# EAGLE design AmbilightUSB (EAGLE 5.10)
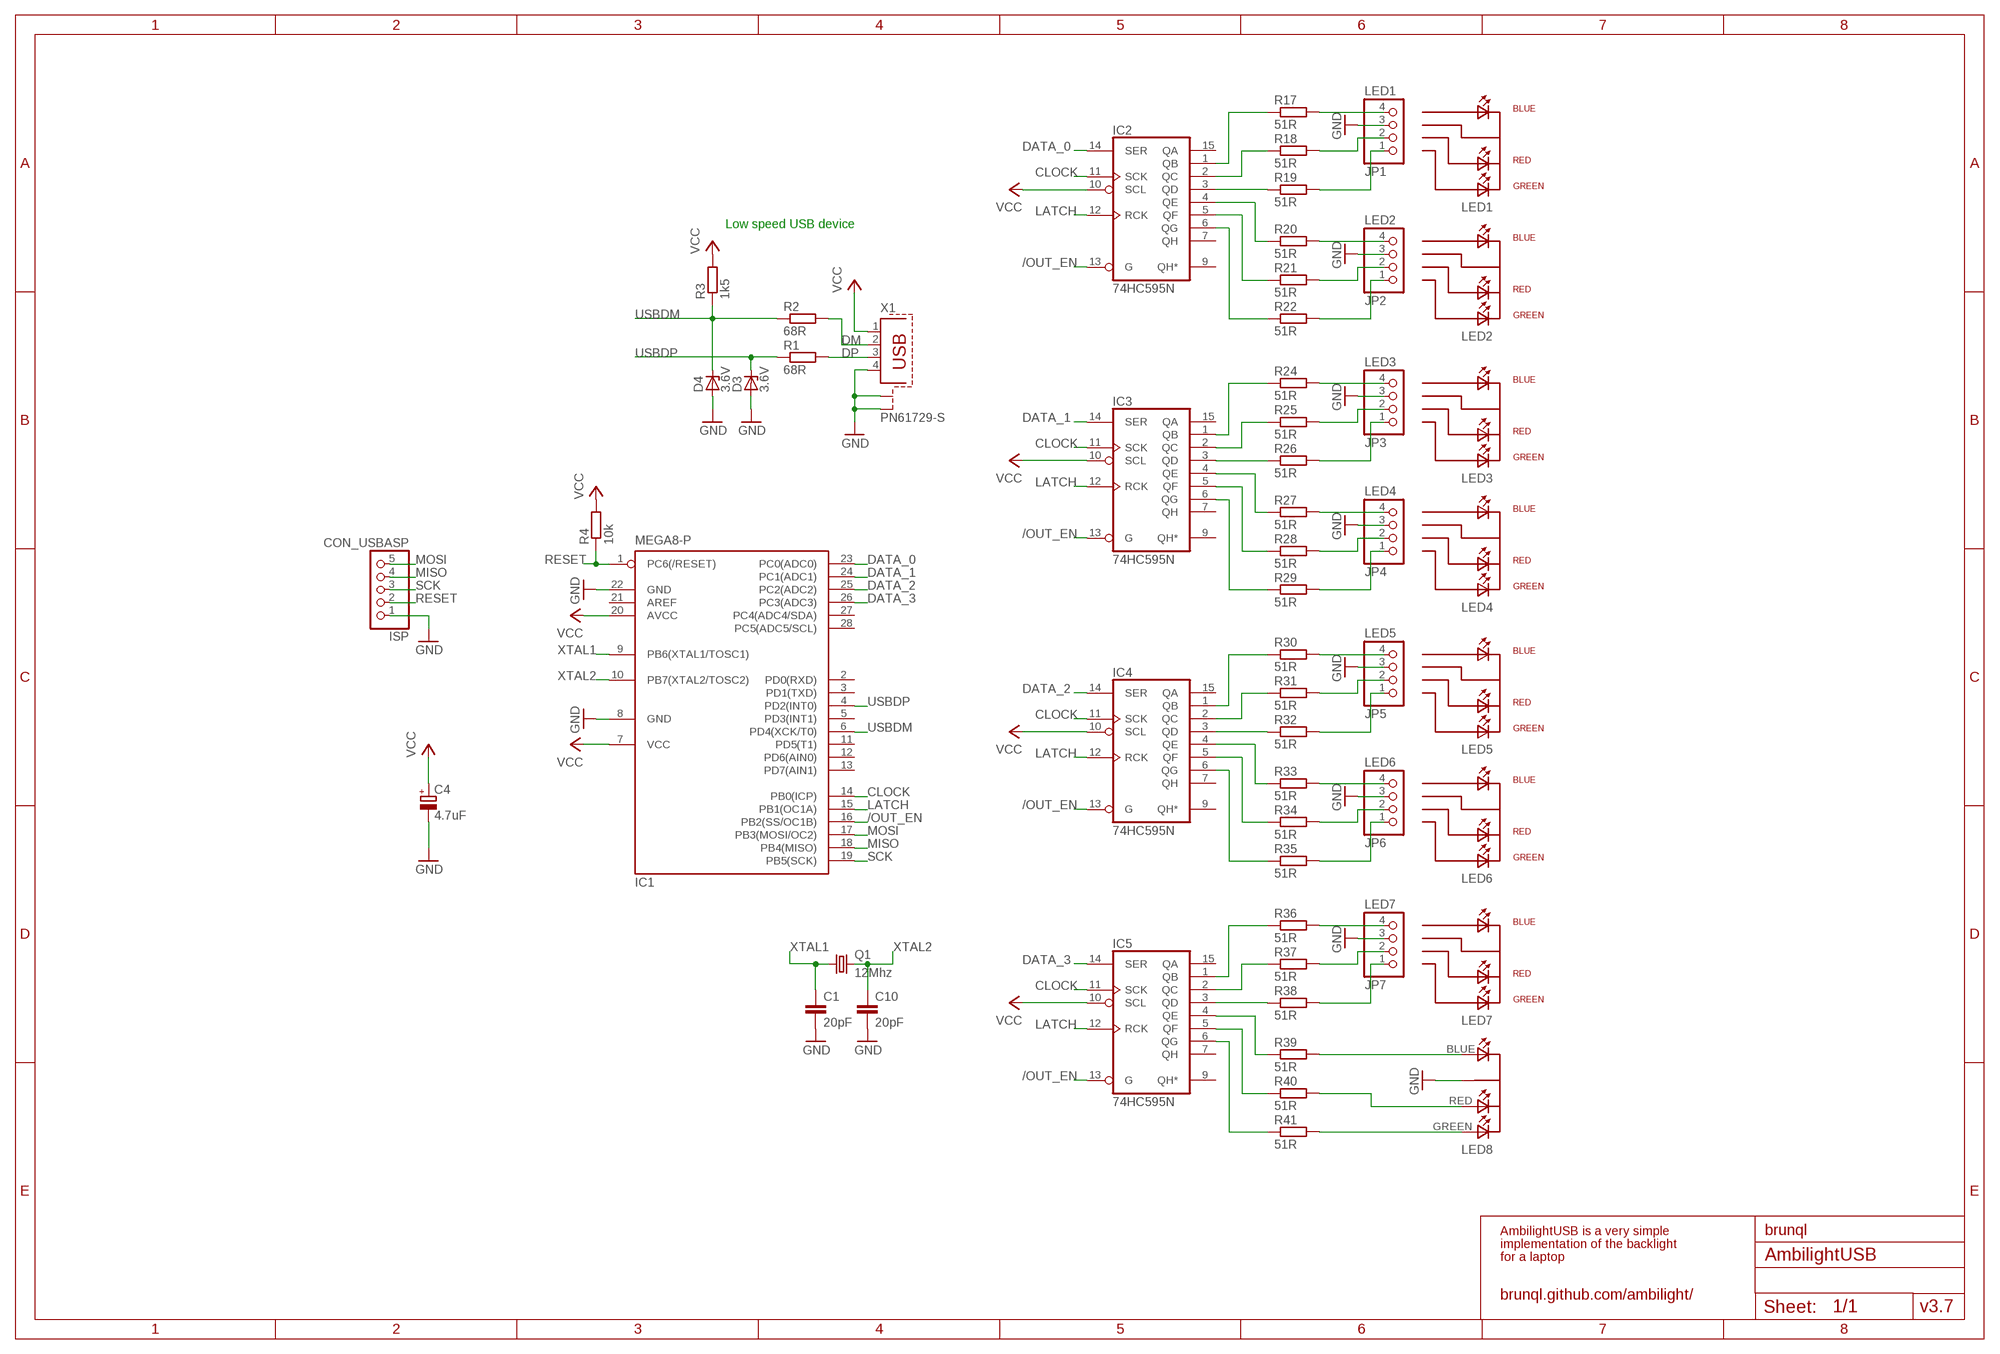
[diagram p0: schematic, sheet 1]

## Parts
C1  20pF  C-EU025-025X050  [C025-025X050]
C4  4.7uF  CPOL-EUE2-5  [E2-5]
C10  20pF  C-EU025-025X050  [C025-025X050]
D3  3.6V  ZENER-DIODEDO35Z10  [DO35Z10]
D4  3.6V  ZENER-DIODEDO35Z10  [DO35Z10]
IC1  MEGA8-P  [DIL28-3]
IC2  74HC595N  [DIL16]
IC3  74HC595N  [DIL16]
IC4  74HC595N  [DIL16]
IC5  74HC595N  [DIL16]
ISP  CON_USBASP  PINHD-1X5  [1X05]
JP1  LED1  PINHD-1X4/90  [1X04/90]
JP2  LED2  PINHD-1X4/90  [1X04/90]
JP3  LED3  PINHD-1X4/90  [1X04/90]
JP4  LED4  PINHD-1X4/90  [1X04/90]
JP5  LED5  PINHD-1X4/90  [1X04/90]
JP6  LED6  PINHD-1X4/90  [1X04/90]
JP7  LED7  PINHD-1X4/90  [1X04/90]
LED1  LED-DIP-3-TO-BLS-SOCKET  [LED-TO-BLS-SOCKET]
LED2  LED-DIP-3-TO-BLS-SOCKET  [LED-TO-BLS-SOCKET]
LED3  LED-DIP-3-TO-BLS-SOCKET  [LED-TO-BLS-SOCKET]
LED4  LED-DIP-3-TO-BLS-SOCKET  [LED-TO-BLS-SOCKET]
LED5  LED-DIP-3-TO-BLS-SOCKET  [LED-TO-BLS-SOCKET]
LED6  LED-DIP-3-TO-BLS-SOCKET  [LED-TO-BLS-SOCKET]
LED7  LED-DIP-3-TO-BLS-SOCKET  [LED-TO-BLS-SOCKET]
LED8  LED-DIP-3  [DIP-4]
Q1  12Mhz  CRYSTALHC49S  [HC49/S]
R1  68R  R-EU_0207/10  [0207/10]
R2  68R  R-EU_0207/10  [0207/10]
R3  1k5  R-EU_0207/10  [0207/10]
R4  10k  R-EU_0207/10  [0207/10]
R17  51R  R-EU_0207/10  [0207/10]
R18  51R  R-EU_0207/10  [0207/10]
R19  51R  R-EU_0207/10  [0207/10]
R20  51R  R-EU_0207/10  [0207/10]
R21  51R  R-EU_0207/10  [0207/10]
R22  51R  R-EU_0207/10  [0207/10]
R24  51R  R-EU_0207/10  [0207/10]
R25  51R  R-EU_0207/10  [0207/10]
R26  51R  R-EU_0207/10  [0207/10]
R27  51R  R-EU_0207/10  [0207/10]
R28  51R  R-EU_0207/10  [0207/10]
R29  51R  R-EU_0207/10  [0207/10]
R30  51R  R-EU_0207/10  [0207/10]
R31  51R  R-EU_0207/10  [0207/10]
R32  51R  R-EU_0207/10  [0207/10]
R33  51R  R-EU_0207/10  [0207/10]
R34  51R  R-EU_0207/10  [0207/10]
R35  51R  R-EU_0207/10  [0207/10]
R36  51R  R-EU_0207/10  [0207/10]
R37  51R  R-EU_0207/10  [0207/10]
R38  51R  R-EU_0207/10  [0207/10]
R39  51R  R-EU_0207/10  [0207/10]
R40  51R  R-EU_0207/10  [0207/10]
R41  51R  R-EU_0207/10  [0207/10]
X1  PN61729-S  [PN61729-S]

## Nets
/OUT_EN: IC1.16(PB2(SS/OC1B)) IC2.13(G) IC3.13(G) IC4.13(G) IC5.13(G)
CLOCK: IC1.14(PB0(ICP)) IC2.11(SCK) IC3.11(SCK) IC4.11(SCK) IC5.11(SCK)
DATA_0: IC1.23(PC0(ADC0)) IC2.14(SER)
DATA_1: IC1.24(PC1(ADC1)) IC3.14(SER)
DATA_2: IC1.25(PC2(ADC2)) IC4.14(SER)
DATA_3: IC1.26(PC3(ADC3)) IC5.14(SER)
DM: R2.2 X1.2
DP: R1.2 X1.3
GND: C1.2 C4.- C10.2 D3.A D4.A IC1.8(GND) IC1.22(GND) ISP.1 JP1.3 JP2.3 JP3.3 JP4.3 JP5.3 JP6.3 JP7.3 LED8.COMMON_CATHODE(COM-CATHODE) X1.4 X1.S1 X1.S2
LATCH: IC1.15(PB1(OC1A)) IC2.12(RCK) IC3.12(RCK) IC4.12(RCK) IC5.12(RCK)
MISO: IC1.18(PB4(MISO)) ISP.4
MOSI: IC1.17(PB3(MOSI/OC2)) ISP.5
N$1: JP2.1 R22.2
N$2: JP2.2 R21.2
N$3: JP1.1 R19.2
N$4: JP1.2 R18.2
N$5: JP3.1 R26.2
N$6: IC2.1(QB) R17.1
N$7: JP3.2 R25.2
N$8: JP4.1 R29.2
N$10: IC2.2(QC) R18.1
N$11: LED8.BLUE R39.2
N$12: IC2.3(QD) R19.1
N$13: JP1.4 R17.2
N$14: JP2.4 R20.2
N$15: JP7.4 R36.2
N$16: JP6.4 R33.2
N$17: JP5.4 R30.2
N$18: JP4.4 R27.2
N$19: IC2.6(QG) R22.1
N$20: IC2.5(QF) R21.1
N$21: JP3.4 R24.2
N$22: IC5.3(QD) R38.1
N$23: IC4.3(QD) R32.1
N$24: IC3.3(QD) R26.1
N$25: LED8.RED R40.2
N$26: IC2.4(QE) R20.1
N$27: LED8.GREEN R41.2
N$46: IC3.1(QB) R24.1
N$47: IC3.2(QC) R25.1
N$49: IC3.6(QG) R29.1
N$50: IC3.5(QF) R28.1
N$51: IC3.4(QE) R27.1
N$56: JP4.2 R28.2
N$66: IC4.1(QB) R30.1
N$67: IC4.2(QC) R31.1
N$69: IC4.6(QG) R35.1
N$70: IC4.5(QF) R34.1
N$71: IC4.4(QE) R33.1
N$73: JP5.2 R31.2
N$74: JP5.1 R32.2
N$75: JP6.1 R35.2
N$76: JP6.2 R34.2
N$86: IC5.1(QB) R36.1
N$87: IC5.2(QC) R37.1
N$89: IC5.6(QG) R41.1
N$90: IC5.5(QF) R40.1
N$91: IC5.4(QE) R39.1
N$93: JP7.2 R37.2
N$94: JP7.1 R38.2
RESET: IC1.1(PC6(/RESET)) ISP.2 R4.1
SCK: IC1.19(PB5(SCK)) ISP.3
USBDM: D4.C IC1.6(PD4(XCK/T0)) R2.1 R3.1
USBDP: D3.C IC1.4(PD2(INT0)) R1.1
VCC: C4.+ IC1.7(VCC) IC1.20(AVCC) IC2.10(SCL) IC3.10(SCL) IC4.10(SCL) IC5.10(SCL) R3.2 R4.2 X1.1
XTAL1: C1.1 IC1.9(PB6(XTAL1/TOSC1)) Q1.1
XTAL2: C10.1 IC1.10(PB7(XTAL2/TOSC2)) Q1.2
Unconnected: IC1.2(PD0(RXD)) IC1.3(PD1(TXD)) IC1.5(PD3(INT1)) IC1.11(PD5(T1)) IC1.12(PD6(AIN0)) IC1.13(PD7(AIN1)) IC1.21(AREF) IC1.27(PC4(ADC4/SDA)) IC1.28(PC5(ADC5/SCL)) IC2.7(QH) IC2.9(QH*) IC2.15(QA) IC3.7(QH) IC3.9(QH*) IC3.15(QA) IC4.7(QH) IC4.9(QH*) IC4.15(QA) IC5.7(QH) IC5.9(QH*) IC5.15(QA)

## Notes on the sheet
- Low speed USB device
- AmbilightUSB is a very simple | brunql
- implementation of the backlight
- for a laptop
- brunql.github.com/ambilight/
- v3.7

## Power pins joined to a net without a drawn wire
GND: IC2.8(GND) IC3.8(GND) IC4.8(GND) IC5.8(GND)
VCC: IC2.16(VCC) IC3.16(VCC) IC4.16(VCC) IC5.16(VCC)

## Library data of the parts
C1 C10 = rcl:C-EU: CAPACITOR, European symbol
C4 = rcl:CPOL-EU: POLARIZED CAPACITOR, European symbol
D3 D4 = diode:ZENER-DIODE: Z-Diode
IC1 = atmel:MEGA8-P: MICROCONTROLLER 8 Kbytes FLASH, 1 kbytes SRAM, 512 bytes EEPROM, USART, 4-channel 10 bit ADC, 2-channel 8 bit ADC Pin compatible with Atmega48, ATMega88, ATMega168 Source: avr.lbr
IC2-IC5 = 74xx-eu:74*595: 8-bit SHIFT REGISTER, output latch
ISP = pinhead:PINHD-1X5: PIN HEADER
JP1-JP7 = pinhead:PINHD-1X4: PIN HEADER
LED1-LED7 = led-rgb:LED-DIP-3-TO-BLS-SOCKET: RGB DIP LED Edited: brunql DIP 4 Pin Special for AmbilightUSB
LED8 = led-rgb:LED-DIP-3: RGB DIP LED Edited: brunql DIP 4 Pin Special for AmbilightUSB
Q1 = crystal:CRYSTAL: CRYSTAL
R1-R4 R17-R22 R24-R41 = rcl:R-EU_: RESISTOR, European symbol
X1 = con-berg:PN61729-S: BERG USB connector

## Board
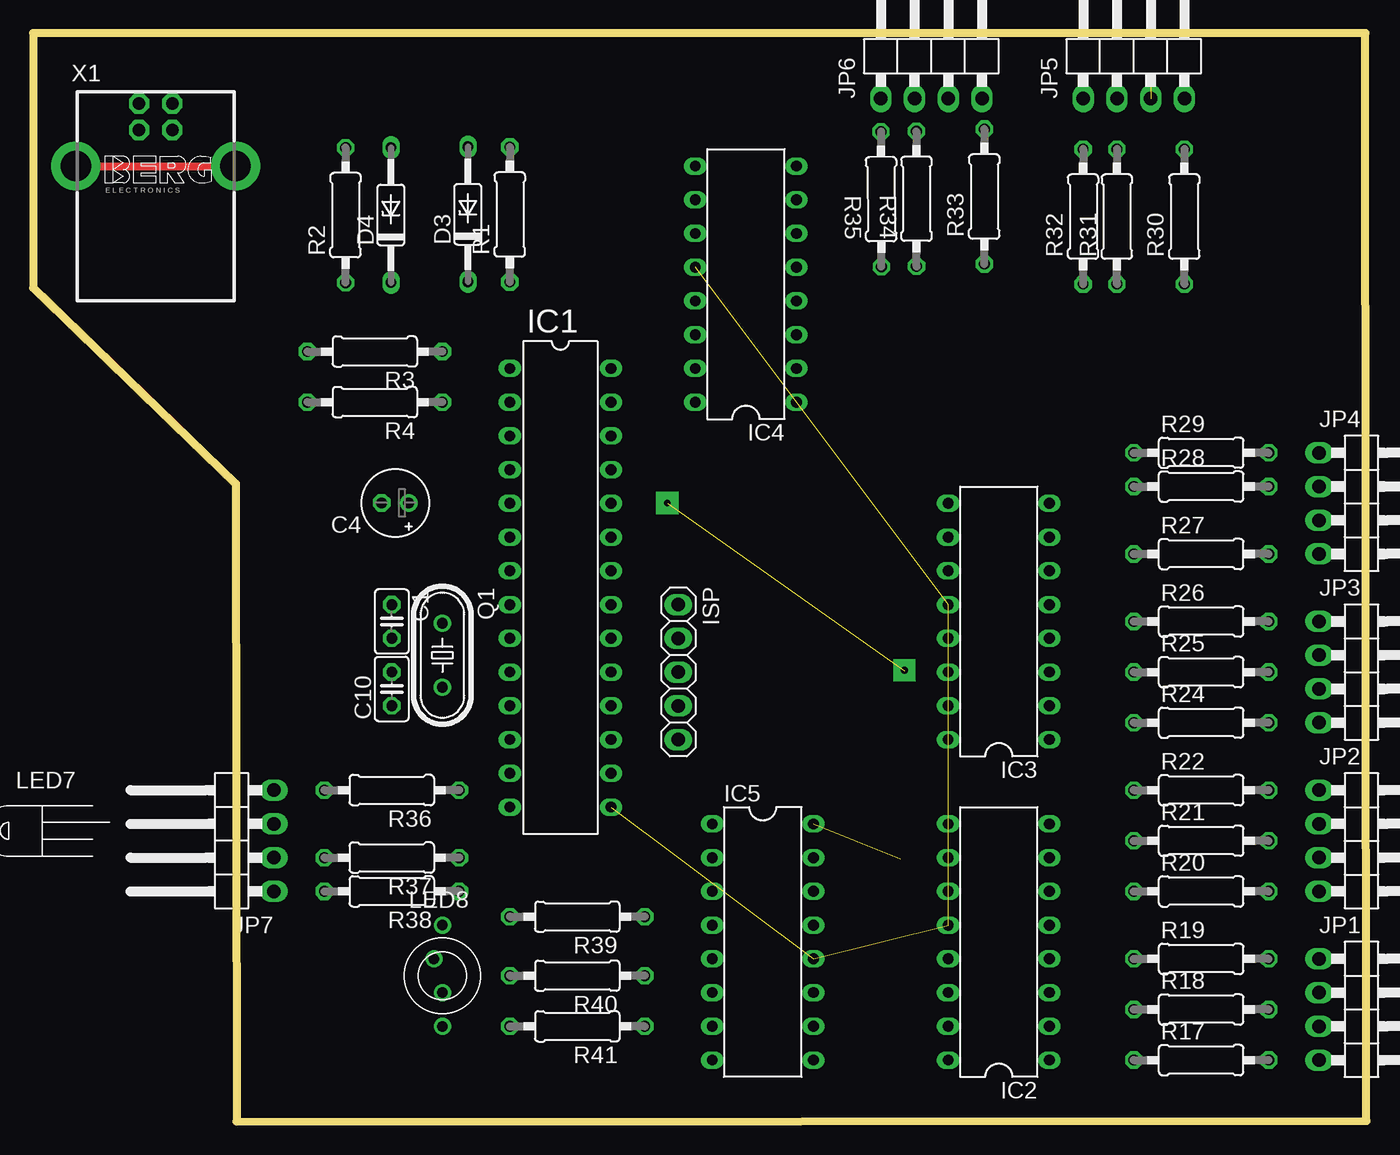
[diagram p1: board, top side]
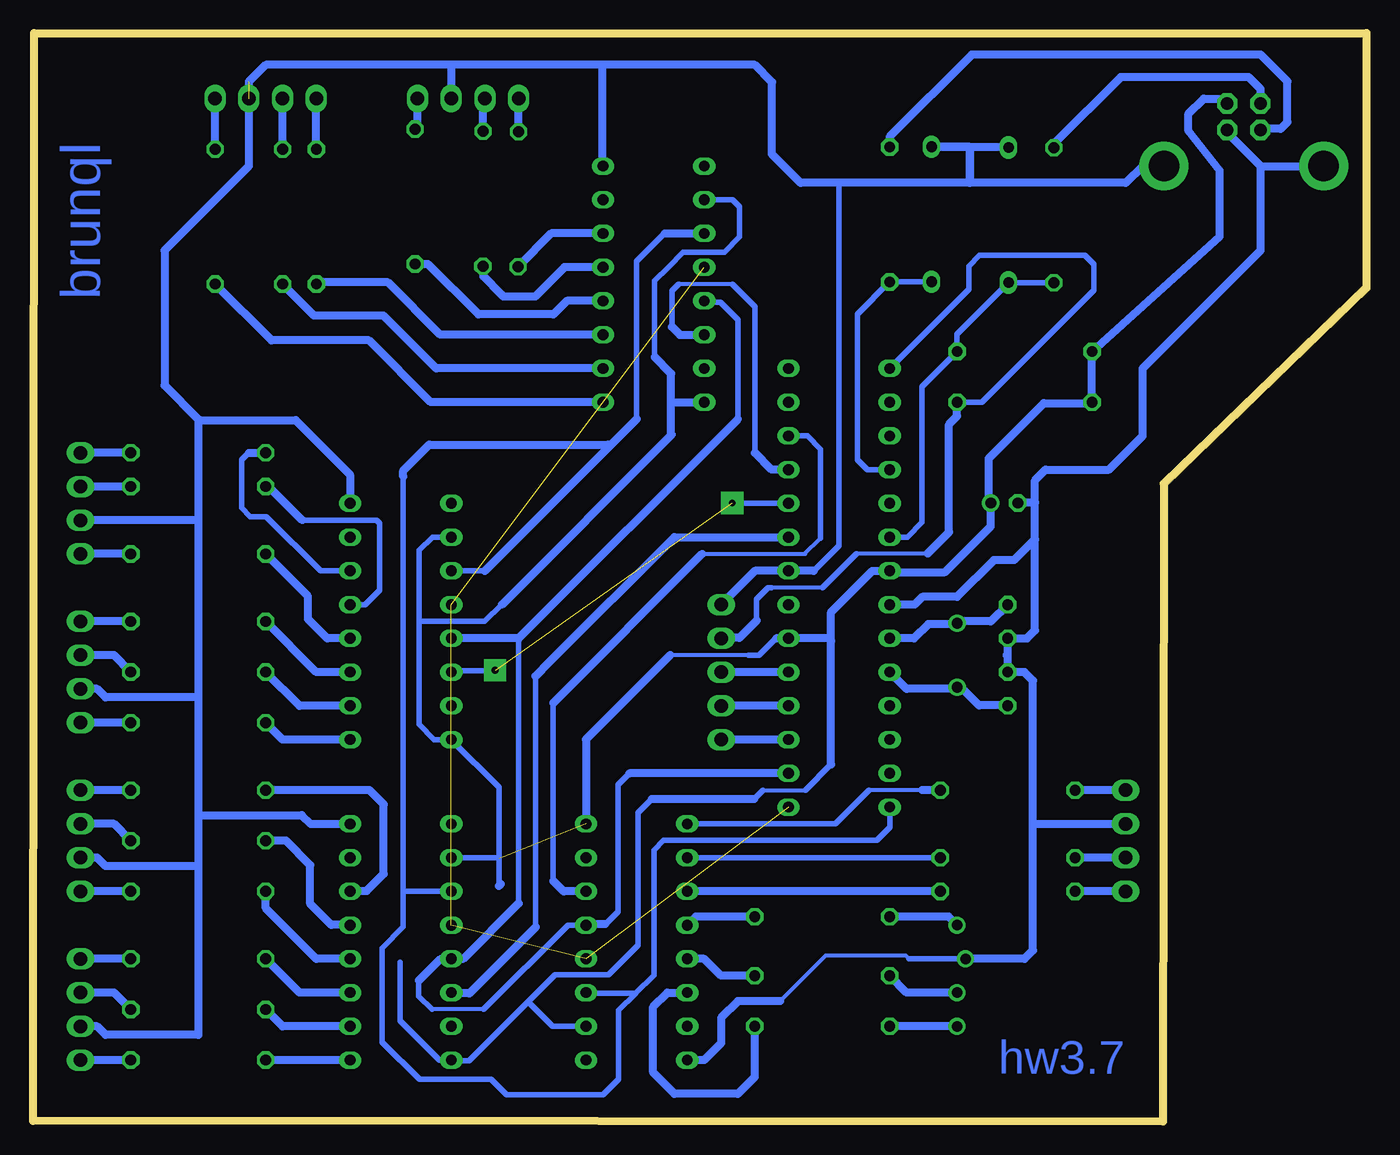
[diagram p2: board, bottom side, seen from below]

Size 100.4 x 81.95 mm. Coordinates in mm from the lower left corner, seen from the top.
Outline: 100.4,0.05 100.33,81.95 0,81.95 0,62.78 15.25,48.04 15.32,0 100.4,0.05
Copper layers (1*16): Top 0.035mm / dielectric 1.5mm / Bottom 0.035mm
Design rules "brunql *": minimum track width 0.32mm, minimum drill 0.8mm, track to track 1mm, track to pad 1mm, pad to pad 1mm, via to via 1mm, smd to smd 0.5mm, copper to edge 2mm, drill to drill 1mm, minimum pad ring 0.2mm, minimum via ring 8mil, stop-mask expansion 4mil, vias tented up to drill 0mil, thermal gap 0.2mm

### Footprints (pad centres in the part's own frame; a part is rotated, then mirrored left to right if it is on the bottom)
C025-025X050 = drill 0.813 octagon: 1 -1.27,0; 2 1.27,0
E2-5 = drill 0.813 pad 1.27 round: + -1.016,0 | drill 0.813 pad 1.27 octagon: - 1.016,0
DO35Z10 = drill 0.813 long: A 5.08,0; C -5.08,0
DIL28-3 = drill 0.813 long: 1 -16.51,-3.81; 2 -13.97,-3.81; 3 -11.43,-3.81; 4 -8.89,-3.81; 5 -6.35,-3.81; 6 -3.81,-3.81; 7 -1.27,-3.81; 8 1.27,-3.81; 9 3.81,-3.81; 10 6.35,-3.81; 11 8.89,-3.81; 12 11.43,-3.81; 13 13.97,-3.81; 14 16.51,-3.81; 15 16.51,3.81; 16 13.97,3.81; 17 11.43,3.81; 18 8.89,3.81; 19 6.35,3.81; 20 3.81,3.81; 21 1.27,3.81; 22 -1.27,3.81; 23 -3.81,3.81; 24 -6.35,3.81; 25 -8.89,3.81; 26 -11.43,3.81; 27 -13.97,3.81; 28 -16.51,3.81
DIL16 = drill 0.813 long: 1 -8.89,-3.81; 2 -6.35,-3.81; 3 -3.81,-3.81; 4 -1.27,-3.81; 5 1.27,-3.81; 6 3.81,-3.81; 7 6.35,-3.81; 8 8.89,-3.81; 9 8.89,3.81; 10 6.35,3.81; 11 3.81,3.81; 12 1.27,3.81; 13 -1.27,3.81; 14 -3.81,3.81; 15 -6.35,3.81; 16 -8.89,3.81
1X05 = drill 1.016 long: 1 -5.08,0; 2 -2.54,0; 3 0,0; 4 2.54,0; 5 5.08,0
1X04/90 = drill 1.016 long: 1 -3.81,-3.81; 2 -1.27,-3.81; 3 1.27,-3.81; 4 3.81,-3.81
DIP-4 = drill 0.8 round: BLUE 0,5.08; COMMON_CATHODE -0.635,2.54; GREEN 0,-2.54; RED 0,0
HC49/S = drill 0.813 round: 1 -2.413,0; 2 2.413,0
0207/10 = drill 0.813 octagon: 1 -5.08,0; 2 5.08,0
PN61729-S = drill 0.95 octagon: 1 1.25,4.71; 2 -1.25,4.71; 3 -1.25,2.71; 4 1.25,2.71 | drill 2.3 pad 2.9 round: S1 -6.02,0; S2 6.02,0

### Placement (x,y rotation side)
C1  27.01,37.66 270 top
C4  27.27,46.58 180 top
C10  27.01,32.58 90 top
D3  32.74,68.31 90 top
D4  26.94,68.26 90 top
IC1  39.7,40.2 270 top
IC2  72.72,13.53 90 top
IC3  72.72,37.66 90 top
IC4  53.68,63.06 90 top
IC5  54.95,13.53 270 top
ISP  48.59,33.85 270 top
JP1  100.66,8.45 270 top
JP2  100.66,21.15 270 top
JP3  100.66,33.85 270 top
JP4  100.66,46.55 270 top
JP5  82.88,80.84 0 top
JP6  67.64,80.84 0 top
JP7  14.31,21.15 90 top
LED1  114.64,9.56 0 top  (outside the outline)
LED2  113.89,21.11 0 top  (outside the outline)
LED3  114.23,33.9 0 top  (outside the outline)
LED4  114.29,46.55 0 top  (outside the outline)
LED5  82.46,94.22 90 top  (outside the outline)
LED6  67.65,93.41 90 top  (outside the outline)
LED7  1.96,21.26 180 top
LED8  30.82,9.72 0 top
Q1  30.82,35.12 270 top
R1  35.9,68.3 90 top
R2  23.52,68.25 90 top
R3  25.73,57.98 180 top
R4  25.73,54.17 180 top
R17  87.96,4.64 0 top
R18  87.96,8.45 0 top
R19  87.96,12.26 0 top
R20  87.96,17.34 0 top
R21  87.96,21.15 0 top
R22  87.96,24.96 0 top
R24  87.96,30.04 0 top
R25  87.96,33.85 0 top
R26  87.96,37.66 0 top
R27  87.96,42.74 0 top
R28  87.96,47.82 0 top
R29  87.96,50.36 0 top
R30  86.69,68.14 90 top
R31  81.61,68.14 90 top
R32  79.07,68.14 90 top
R33  71.63,69.64 90 top
R34  66.52,69.48 90.1 top
R35  63.87,69.45 90.2 top
R36  27.01,24.96 180 top
R37  27.01,19.88 180 top
R38  27.01,17.34 180 top
R39  40.98,15.43 180 top
R40  40.98,10.99 180 top
R41  40.98,7.18 180 top
X1  9.23,71.95 0 top

### Tracks (layer width: path | path; a pad name or v marks a point on that pad's centre or on a via)
/OUT_EN
  Bottom 0.305: 66.47,8.45 70.35,8.45
  Bottom 0.406: 63.84,16.43 63.84,36.39 | 70.35,8.45 71.36,9.46 71.36,10.61 | IC5.13 60.12,14.8 66.47,8.45 | 47.33,52.9 47.33,60.39 48.62,61.68 49.76,61.68 IC4.13 | 55.5,26.23 56.34,25.38 56.34,15.82 57.28,14.88 57.31,14.88
  Bottom 0.61: IC3.13 63.84,36.39 47.33,52.9 | IC1.16 55.5,26.23 | 57.31,14.88 58.68,14.88 IC5.13 | 63.84,16.43 68,12.27 IC2.13 69.71,12.26 71.36,10.61
CLOCK
  Bottom 0.406: 52.84,66.87 54.95,64.76 54.95,52.9 | IC1.14 35.9,22.15 36.87,21.18 52.92,21.18 53.65,20.44 53.65,11.03 55.03,9.65 | 72.53,17.24 72.53,14.66 74.12,13.07 74.12,6 71.31,3.19 65.93,3.19 64.76,2.02 57.48,2.02 56.31,3.2 56.31,8.37 55.03,9.64 55.03,9.65 | IC2.11 72.43,17.34 72.53,17.24 | 72.53,17.24 72.53,48.56 | 66.38,41.47 IC3.11 | IC5.11 58.69,9.65 55.03,9.65
  Bottom 0.61: 56.97,50.87 54.95,52.9 54.96,52.91 | 56.97,50.87 66.38,41.47 | 52.84,66.87 IC4.11 | 72.53,48.56 72.53,49.01 70.57,50.97 57.07,50.97 56.97,50.87
DATA_0
  Bottom 0.406: 62.56,14.64 62.56,33.56 61.55,34.57
  Bottom 0.61: IC1.23 52.11,44.01 61.55,34.57 62.58,33.54 | 62.56,14.64 67.55,9.66 68.85,9.66 IC2.14
DATA_1  (1 unrouted)
  Bottom 0.406: IC1.24 47.78,46.54 | IC3.14 68.8,33.96 65.63,33.96
DATA_2
  Bottom 0.305: 47.73,63.04 51.77,63.04
  Bottom 0.406: 51.77,63.04 51.78,63.06 52.3,62.54 52.3,59.83 | 46.05,50.36 46.05,61.36 47.73,63.04
  Bottom 0.61: 46.05,50.36 44.79,49.09 IC1.25 | IC4.14 49.88,59.23 51.7,59.23 52.3,59.83
DATA_3
  Bottom 0.305: 50.02,42.74 42.3,42.74 | 42.3,42.74 42.24,42.74 | 42.3,42.74 41.1,43.93
  Bottom 0.406: 61.25,18.13 61.25,31.51 | IC1.26 42.09,51.63 41.1,50.64 41.1,43.93
  Bottom 0.61: IC5.14 60.45,17.34 61.25,18.13 | 61.25,31.51 50.02,42.74
DM
  Bottom 0.61: X1.2 7.95,76.68 7.95,77.73 8.87,78.65 18.5,78.65 23.52,73.63 R2.2
DP
  Bottom 0.61: X1.3 7.9,74.74 6.46,74.74 5.94,75.26 5.94,78.32 7.96,80.34 29.71,80.34 35.9,74.15 R1.2
GND  (1 unrouted)
  Top 0.61: X1.S1 X1.S2
  Bottom 0.305: 34.43,12.26 34.68,12.51 40.73,12.51 44.15,9.08
  Bottom 0.406: 39.7,70.68 39.7,43.37 41.61,41.47 | 87.96,22.97 87.83,23.11 | LED8.COMMON_CATHODE 34.43,12.26 | 26.99,73.39 D4.A | 29.85,70.88 29.91,70.82
  Bottom 0.61: 27.01,35.05 C10.2 25.73,33.85 25.1,33.21 25.1,22.42 | 27.01,35.05 C1.2 25.56,36.39 24.96,36.99 24.96,43.85 | 15.58,71.95 X1.S2 16.85,71.95 18.12,70.68 29.86,70.68 | 7.96,71.95 10.5,74.49 X1.4 | 7.96,71.95 X1.S1 | 68.91,79.57 JP6.3 | 57.57,79.57 46.05,79.57 44.75,78.26 44.77,78.25 44.77,72.84 42.6,70.68 39.7,70.68 29.86,70.68 | 57.57,79.57 68.91,79.57 | 7.96,71.95 7.96,65.6 16.85,56.71 16.85,51.63 19.39,49.09 24.15,49.09 24.96,48.28 24.96,46.61 | 41.61,41.47 IC1.22 46.05,41.47 ISP.1 | IC5.8 49.87,4.64 48.59,5.91 48.59,7.81 47.33,9.08 44.15,9.08 | LED8.COMMON_CATHODE 25.73,12.26 25.1,12.89 25.1,22.42 | 25.1,22.42 JP7.3 | 68.91,79.57 82.88,79.57 84.15,78.3 84.15,71.95 90.5,65.6 90.5,55.44 87.96,52.9 | 87.96,52.9 87.96,45.28 | 87.96,45.28 JP4.3 | 87.96,45.28 87.96,31.94 | JP1.3 95.58,7.18 94.95,6.54 87.96,6.54 87.96,19.24 | 87.96,31.94 87.96,22.97 87.96,19.24 | JP2.3 95.58,19.88 94.95,19.24 87.96,19.24 | JP3.3 95.58,32.58 94.95,31.94 87.96,31.94 | 27.01,35.05 27.08,35.12 27.1,35.1 | 24.96,43.85 24.96,46.61 | C4.- 24.99,46.58 24.96,46.61 | IC1.8 34.02,38.93 33.44,39.51 30.82,39.51 28.06,42.28 26.53,42.28 24.96,43.85 | IC3.8 76.53,48.72 80.63,52.82 87.88,52.82 87.96,52.9 | IC4.8 57.57,71.95 57.57,79.57 | 29.86,73.39 26.99,73.39 | 29.86,73.39 D3.A 29.86,73.39 29.86,70.68 | 29.85,70.88 29.86,70.88 29.86,73.39 | IC2.8 79.5,22.42 80.17,23.09 87.81,23.09 87.83,23.11
LATCH  (4 unrouted)
MISO
  Bottom 0.61: IC1.18 ISP.4
MOSI
  Bottom 0.61: IC1.17 ISP.5
N$1
  Bottom 0.61: R22.2 JP2.1
N$2
  Bottom 0.61: R21.2 94.31,22.42 JP2.2
N$3
  Bottom 0.61: R19.2 JP1.1
N$4
  Bottom 0.61: R18.2 94.31,9.72 JP1.2
N$5
  Bottom 0.61: R26.2 JP3.1
N$6
  Bottom 0.61: IC2.1 R17.1
N$7
  Bottom 0.61: R25.2 94.31,35.12 JP3.2
N$8
  Bottom 0.61: R29.2 JP4.1
N$10
  Bottom 0.61: IC2.2 81.61,7.18 R18.1
N$11
  Bottom 0.61: R39.2 31.45,15.43 LED8.BLUE
N$12
  Bottom 0.61: IC2.3 80.34,9.72 R19.1
N$13
  Bottom 0.61: R17.2 JP1.4
N$14
  Bottom 0.61: R20.2 JP2.4
N$15
  Bottom 0.61: JP7.4 R36.2
N$16
  Bottom 0.61: JP6.4 71.45,74.9 R33.2
N$17
  Bottom 0.61: R30.2 JP5.4
N$18
  Bottom 0.61: R27.2 JP4.4
N$19
  Bottom 0.61: IC2.6 76.49,17.38 75.27,17.38 73.99,18.66 73.99,23.88 75.07,24.96 R22.1
N$20
  Bottom 0.406: R21.1 82.86,21.12
  Bottom 0.61: R21.1 81.36,21.15 79.53,19.32 79.53,16.4 77.95,14.82 76.56,14.82 IC2.5
N$21
  Bottom 0.61: R24.2 JP3.4
N$22
  Bottom 0.61: R38.1 IC5.3
N$23
  Bottom 0.61: IC4.3 69.75,59.25 73.68,63.18 78.95,63.18 R32.1
N$24
  Bottom 0.61: R26.1 79.07,33.85 IC3.3
N$25
  Bottom 0.61: R40.2 34.62,9.72 LED8.RED
N$26
  Bottom 0.61: IC2.4 79.07,12.26 82.88,16.07 R20.1
N$27
  Bottom 0.61: LED8.GREEN R41.2
N$46
  Bottom 0.61: R24.1 81.61,28.77 IC3.1
N$47
  Bottom 0.61: R25.1 80.34,31.31 IC3.2
N$49
  Bottom 0.406: IC3.6 78.77,41.47 82.85,45.55 84.05,45.55 84.7,46.2 84.7,49.82 84.15,50.36
  Bottom 0.61: 84.15,50.36 R29.1
N$50
  Bottom 0.406: 80.14,45.28 80.12,45.27 74.54,45.27 74.32,45.04 74.32,40 75.39,38.93 IC3.5
  Bottom 0.61: R28.1 82.67,47.82 80.14,45.28
N$51
  Bottom 0.61: R27.1 79.7,39.55 79.7,37.83 78.25,36.39 IC3.4
N$56
  Bottom 0.61: R28.2 JP4.2
N$66
  Bottom 0.61: IC4.1 70.46,54.17 75.11,58.82 82.46,58.82 R30.1
N$67
  Bottom 0.61: IC4.2 70.04,56.71 74.02,60.69 79.24,60.69 R31.1
N$69
  Bottom 0.61: IC4.6 61.38,66.87 R35.1
N$70
  Bottom 0.61: IC4.5 60.39,64.33 62.6,62.12 64.98,62.12 65.12,62.26 66.5,63.64 66.5,64.37 R34.1
N$71
  Bottom 0.61: R33.1 70.67,64.57 66.88,60.77 61.22,60.77 60.2,61.8 60.19,61.79 IC4.4
N$73
  Bottom 0.61: R31.2 JP5.2
N$74
  Bottom 0.61: R32.2 JP5.1
N$75
  Bottom 0.61: JP6.1 63.84,74.54 R35.2
N$76
  Bottom 0.61: R34.2 66.51,76.89 JP6.2
N$86
  Bottom 0.305: 33.43,24.96 37.45,24.96
  Bottom 0.406: 37.45,24.96 39.99,22.42 IC5.1
  Bottom 0.61: R36.1 33.43,24.96
N$87
  Bottom 0.406: R37.1 IC5.2
N$89
  Bottom 0.61: R41.1 46.05,3.37 47.33,2.1 52.11,2.1 53.72,3.71 53.72,8.64 52.64,9.72 IC5.6
N$90
  Bottom 0.61: IC5.5 49.87,12.26 48.59,10.99 R40.1
N$91
  Bottom 0.61: IC5.4 50.5,15.43 R39.1
N$93
  Bottom 0.61: JP7.2 R37.2
N$94
  Bottom 0.61: JP7.1 R38.2
RESET
  Bottom 0.305: 40.98,40.2 44.79,40.2 | 33.04,42.77 38.4,42.77
  Bottom 0.406: 38.4,42.77 40.98,40.2 | 44.79,40.2 45.05,40.2 45.91,39.33 45.91,37.72 | 48.56,36.42 ISP.2 | IC1.1 29.94,62.66 29.94,64.41 29.12,65.23 21.21,65.23 20.52,64.54 20.52,62.59 28.94,54.17 R4.1
  Bottom 0.61: R4.1 30.82,53.12 31.43,52.51 31.43,44.38 33.04,42.77 | 45.91,37.72 47.21,36.42 48.56,36.42
S$5  (via drill 0.5 pad 1.68)
  other vias: 47.75,46.58
S$6  (via drill 0.5 pad 1.68)
  other vias: 65.61,33.98
SCK
  Bottom 0.61: IC1.19 ISP.3
USBDM
  Bottom 0.406: R2.1 D4.C 30.82,59.3 R3.1 33.45,55.34 33.45,45.13 34.58,44.01 IC1.6
USBDP
  Bottom 0.406: D3.C R1.1 38.32,60.8 38.32,49.84 37.57,49.09 IC1.4
VCC  (1 unrouted)
  Bottom 0.305: 46.53,35.12 52.43,35.12 | 45.43,24.96 42.24,24.96
  Bottom 0.406: 42.24,24.96 40.31,26.89 | 46.08,24.31 45.43,24.96 | 46.53,35.12 45.72,35.12 44.45,36.39 | 72.77,11.99 72.77,7.6 69.81,4.64 IC2.16 68.87,4.6 67.58,4.6 63.15,9.03 | 65.33,17.75 65.33,19.79 | 65.33,19.79 65.33,25.18 IC3.16 70.2,28.77 71.34,29.91 71.34,37.37 71.32,37.39 71.32,37.79 | 53.6,57.57 53.6,63.29 52.57,64.33 52.57,64.34 51.45,65.46 48.35,65.46 47.2,66.61 47.2,68.86 47.74,69.41 IC4.10 | 53.8,24.31 54.85,23.26 54.85,13.28 57.07,11.06 61.12,11.06 63.15,9.03 | IC3.10 70.33,44.01 71.32,43.01 71.32,37.79 | 65.1,38.93 65.14,38.93 66.4,37.66 71.2,37.66 71.32,37.79 | IC2.10 65.41,19.88 65.33,19.79 | IC5.10 61.3,7.18 63.15,9.03
  Bottom 0.61: X1.1 10.5,77.03 12.25,77.03 13.39,75.89 13.39,74.59 11.04,71.61 11.04,66.65 R3.2 R4.2 20.63,54.17 20.55,54.09 24.28,54.09 28.43,49.94 28.43,46.73 C4.+ 28.28,44.82 31.72,41.38 35.81,41.38 IC1.7 37.2,41.47 40.31,38.36 40.31,36.2 | 65.1,38.93 52.31,51.72 52.35,51.75 52.35,54.21 | 53.6,57.57 52.35,56.32 52.35,54.21 | IC4.16 52.31,54.17 52.35,54.21 | 40.31,26.89 40.31,36.2 | 40.31,36.2 40.5,36.39 IC1.20 44.45,36.39 | 52.43,35.12 58.77,28.77 58.77,22.43 IC5.16 | 53.8,24.31 46.08,24.31 | 65.33,17.75 65.19,17.89
XTAL1
  Bottom 0.61: C1.1 28.28,37.66 30.82,37.66 Q1.1 30.89,37.45 32.99,37.45 34.05,36.39 IC1.9
XTAL2
  Bottom 0.61: IC1.10 34.62,32.58 30.82,32.58 | 30.82,32.58 Q1.2 | 30.82,32.58 30.42,32.58 29.18,31.33 27.03,31.33 C10.1

### Text on the board
Bottom: brunql | hw3.7